# Altium schematic sheet Sheet2-bms.SchDoc
size A3; SheetNumber: 2; SheetTotal: 2
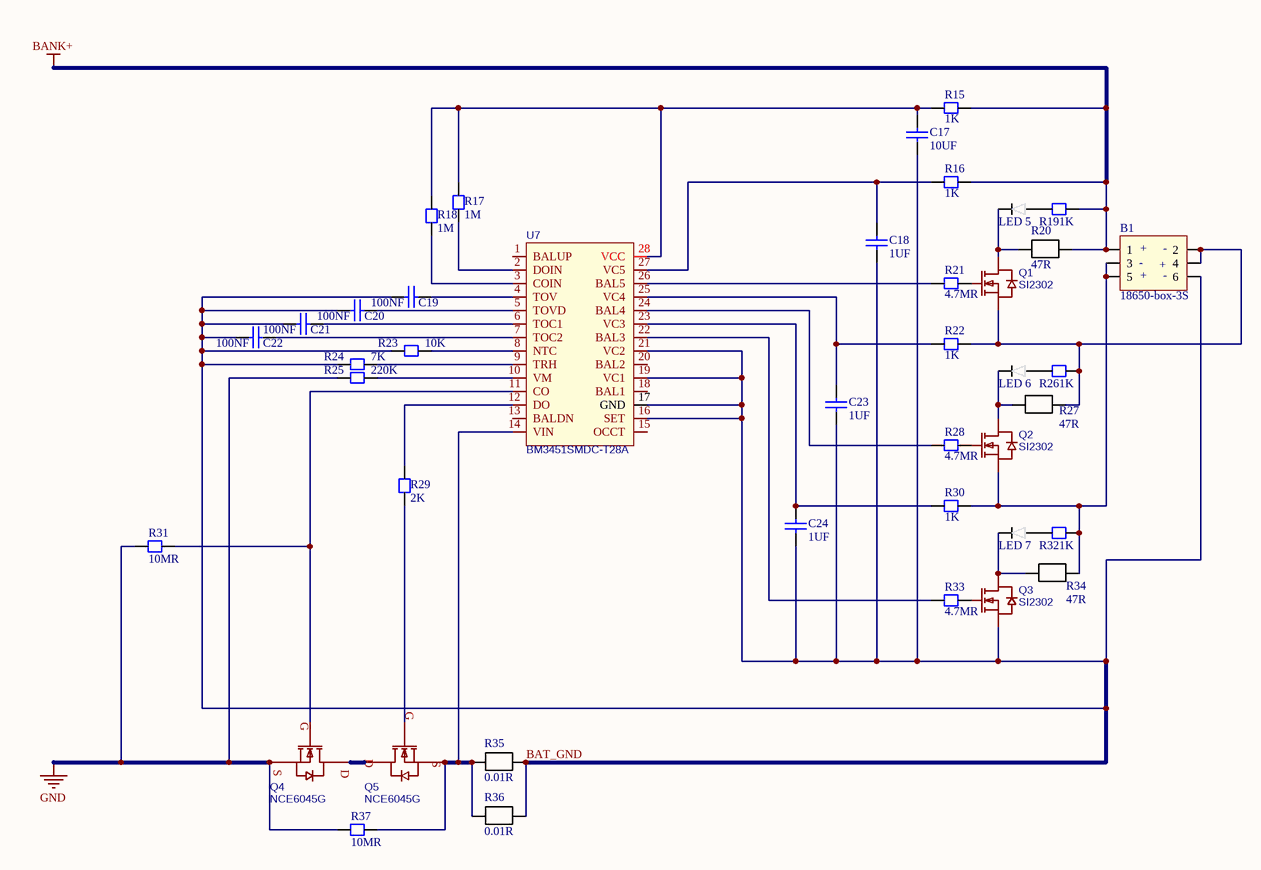
[diagram p0: Sheet2-bms.SchDoc]

## Parts
B1  18650-box-3S  [BAT-SMD_BH-18650-B5BA016]
C17  10UF  [CC1608-0603]
C18  1UF  [CC1608-0603]
C19  100NF  [CC1608-0603]
C20  100NF  [CC1608-0603]
C21  100NF  [CC1608-0603]
C22  100NF  [CC1608-0603]
C23  1UF  [CC1608-0603]
C24  1UF  [CC1608-0603]
LED_5  LED 0603  [LED 0603]  (value not drawn)
LED_6  LED 0603  [LED 0603]  (value not drawn)
LED_7  LED 0603  [LED 0603]  (value not drawn)
Q1  SI2302  [SOT-23]
Q2  SI2302  [SOT-23]
Q3  SI2302  [SOT-23]
Q4  NCE6045G  [DFN-8_L5.8-W4.9-P1.27-LS6.1-BL-2]
Q5  NCE6045G  [DFN-8_L5.8-W4.9-P1.27-LS6.1-BL-2]
R15  1K  [CR1608-0603]
R16  1K  [CR1608-0603]
R17  1M  [CR1608-0603]
R18  1M  [CR1608-0603]
R19  1K  [CR1608-0603]
R20  47R  [Cap Chip 2512]
R21  4.7MR  [CR1608-0603]
R22  1K  [CR1608-0603]
R23  10K  [CR1608-0603]
R24  7K  [CR1608-0603]
R25  220K  [CR1608-0603]
R26  1K  [CR1608-0603]
R27  47R  [Cap Chip 2512]
R28  4.7MR  [CR1608-0603]
R29  2K  [CR1608-0603]
R30  1K  [CR1608-0603]
R31  10MR  [CR1608-0603]
R32  1K  [CR1608-0603]
R33  4.7MR  [CR1608-0603]
R34  47R  [Cap Chip 2512]
R35  0.01R  [Cap Chip 2512]
R36  0.01R  [Cap Chip 2512]
R37  10MR  [CR1608-0603]
U7  BM3451SMDC-T28A  [TSSOP-28]

## Nets
BANK+: B1.1 R15.2 R16.2 R19.2 R20.2
GND: Q4.2(S) R25.2 R31.1 R37.2
BAT_GND: B1.6 C17.1 C18.1 C19.2 C20.2 C21.2 C22.2 C23.1 C24.1 Q3.2(S) R23.2 R24.2 R35.2 R36.2 U7.16(SET) U7.17(GND) U7.19(VC1) U7.21(VC2)
NetB1_2: B1.2 B1.4 Q1.2(S) R22.2 R26.2 R27.2
NetB1_3: B1.3 B1.5 Q2.2(S) R30.2 R32.2 R34.2
NetC17_2: C17.2 R15.1 R17.2 R18.2 U7.28(VCC)
NetC18_2: C18.2 R16.1 U7.27(VC5)
NetC19_1: C19.1 U7.4(TOV)
NetC20_1: C20.1 U7.5(TOVD)
NetC21_1: C21.1 U7.6(TOC1)
NetC22_1: C22.1 U7.7(TOC2)
NetC23_2: C23.2 R22.1 U7.25(VC4)
NetC24_2: C24.2 R30.1 U7.23(VC3)
NetLED_5_1: LED_5.1 R19.1
NetLED_5_2: LED_5.2 Q1.3(D) R20.1
NetLED_6_1: LED_6.1 R26.1
NetLED_6_2: LED_6.2 Q2.3(D) R27.1
NetLED_7_1: LED_7.1 R32.1
NetLED_7_2: LED_7.2 Q3.3(D) R34.1
NetQ1_1: Q1.1(G) R21.2
NetQ2_1: Q2.1(G) R28.2
NetQ3_1: Q3.1(G) R33.2
NetQ4_1: Q4.1(G) R31.2 U7.11(CO)
NetQ4_3: Q4.3(D) Q5.3(D)
NetQ5_1: Q5.1(G) R29.1
NetQ5_2: Q5.2(S) R35.1 R36.1 R37.1 U7.14(VIN)
NetR17_1: R17.1 U7.2(DOIN)
NetR18_1: R18.1 U7.3(COIN)
NetR21_1: R21.1 U7.26(BAL5)
NetR23_1: R23.1 U7.8(NTC)
NetR24_1: R24.1 U7.9(TRH)
NetR25_1: R25.1 U7.10(VM)
NetR28_1: R28.1 U7.24(BAL4)
NetR29_2: R29.2 U7.12(DO)
NetR33_1: R33.1 U7.22(BAL3)

Not connected (* = marked no-connect by the designer): U7 1(BALUP) 13(BALDN) 15(OCCT) 18(BAL1) 20(BAL2)

## Notes on the sheet
- (in symbol 18650-box-3S) +    －

## Library data of the parts
B1 = 18650-box-3S: 18650贴片电池盒
C17-C24 = Cap Chip 0603: 0603封装的电容; Published: 8-Jun-2000; Revision: July-2002: Re-released for DXP Platform.; Publisher: Altium Limited
Q1-Q3 = SI2302: N沟道 / 漏源电压(Vdss) 20V / 连续漏极电流(Id) 2.8A / 功率(Pd) 900mW / 导通电阻(RDS(on)@Vgs,Id) 55mΩ@4.5V,2.8A / 阈值电压(Vgs(th)@Id) 1.2V@250uA / 输入电容(Ciss@Vds) 260pF@10V; Manufacturer: TWGMC(台湾迪嘉); Manufacturer Part: SI2306; Contributor: LCSC; Supplier: LCSC; Supplier Part: C727154; JLCPCB Part Class: Extended Part; spicePre: Q; spiceSymbolName: SI2306_C727154
Q4 Q5 = NCE6045G: 原装NCE6045G DFN-8(5x6) N沟道60V 45A增强型功率MOSFET场效应管; Manufacturer: TWGMC(台湾迪嘉); Manufacturer Part: SI2306; Contributor: LCSC; Supplier: LCSC; Supplier Part: C727154; JLCPCB Part Class: Extended Part; spicePre: Q; spiceSymbolName: SI2306_C727154
R15-R19 R21-R26 R28-R33 R37 = Resistor Chip 0603: 0603封装电阻; Published: 8-Jun-2000; Revision: July-2002: Re-released for DXP Platform.; Publisher: Altium Limited
R20 R27 R34-R36 = Cap Chip 2512
U7 = BM3451SMDC-T28A: Manufacturer: null; Contributor: lcsc; Supplier: LCSC; Supplier Part: C9900155136; Manufacturer Part: BM3451SMDC-T28A; spicePre: U; spiceSymbolName: BM3451SMDC-T28A